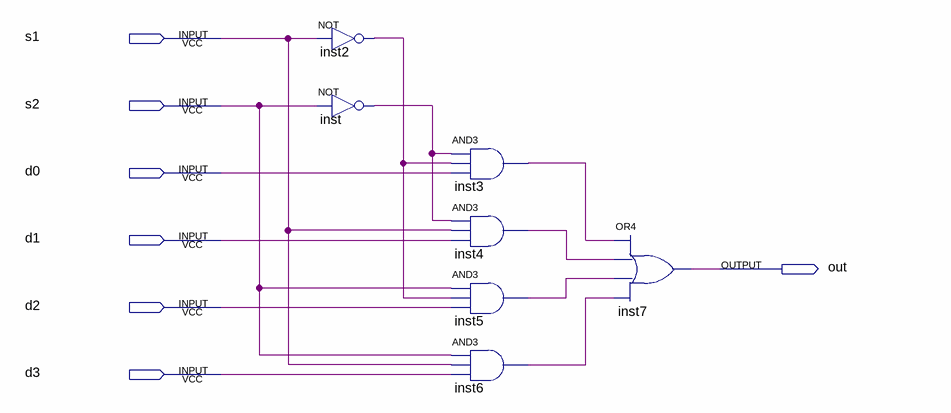
[diagram p0: schematic sheet]
// Quartus schematic MY_SEL4.bdf as structural Verilog: 7 symbols, 7 pins
module MY_SEL4 (
  input  s1,
  input  s2,
  input  d0,
  input  d1,
  input  d2,
  input  d3,
  output out
);

  wire inst2_out, inst3_out, inst4_out, inst5_out, inst6_out, inst_out;

  not inst2 (inst2_out, s1);
  not inst (inst_out, s2);
  and inst3 (inst3_out, inst_out, inst2_out, d0);
  and inst4 (inst4_out, inst_out, s1, d1);
  and inst5 (inst5_out, s2, inst2_out, d2);
  and inst6 (inst6_out, s2, s1, d3);
  or inst7 (out, inst3_out, inst4_out, inst5_out, inst6_out);
endmodule
